# Altium schematic sheet POWER.SchDoc: POWER
size A3; Date: 13/11/2025; DrawnBy: Văn Quý Tuân; Revision: 1; SheetNumber: 1; SheetTotal: 10; Size: A3; Subsystem: HW-11/11/25
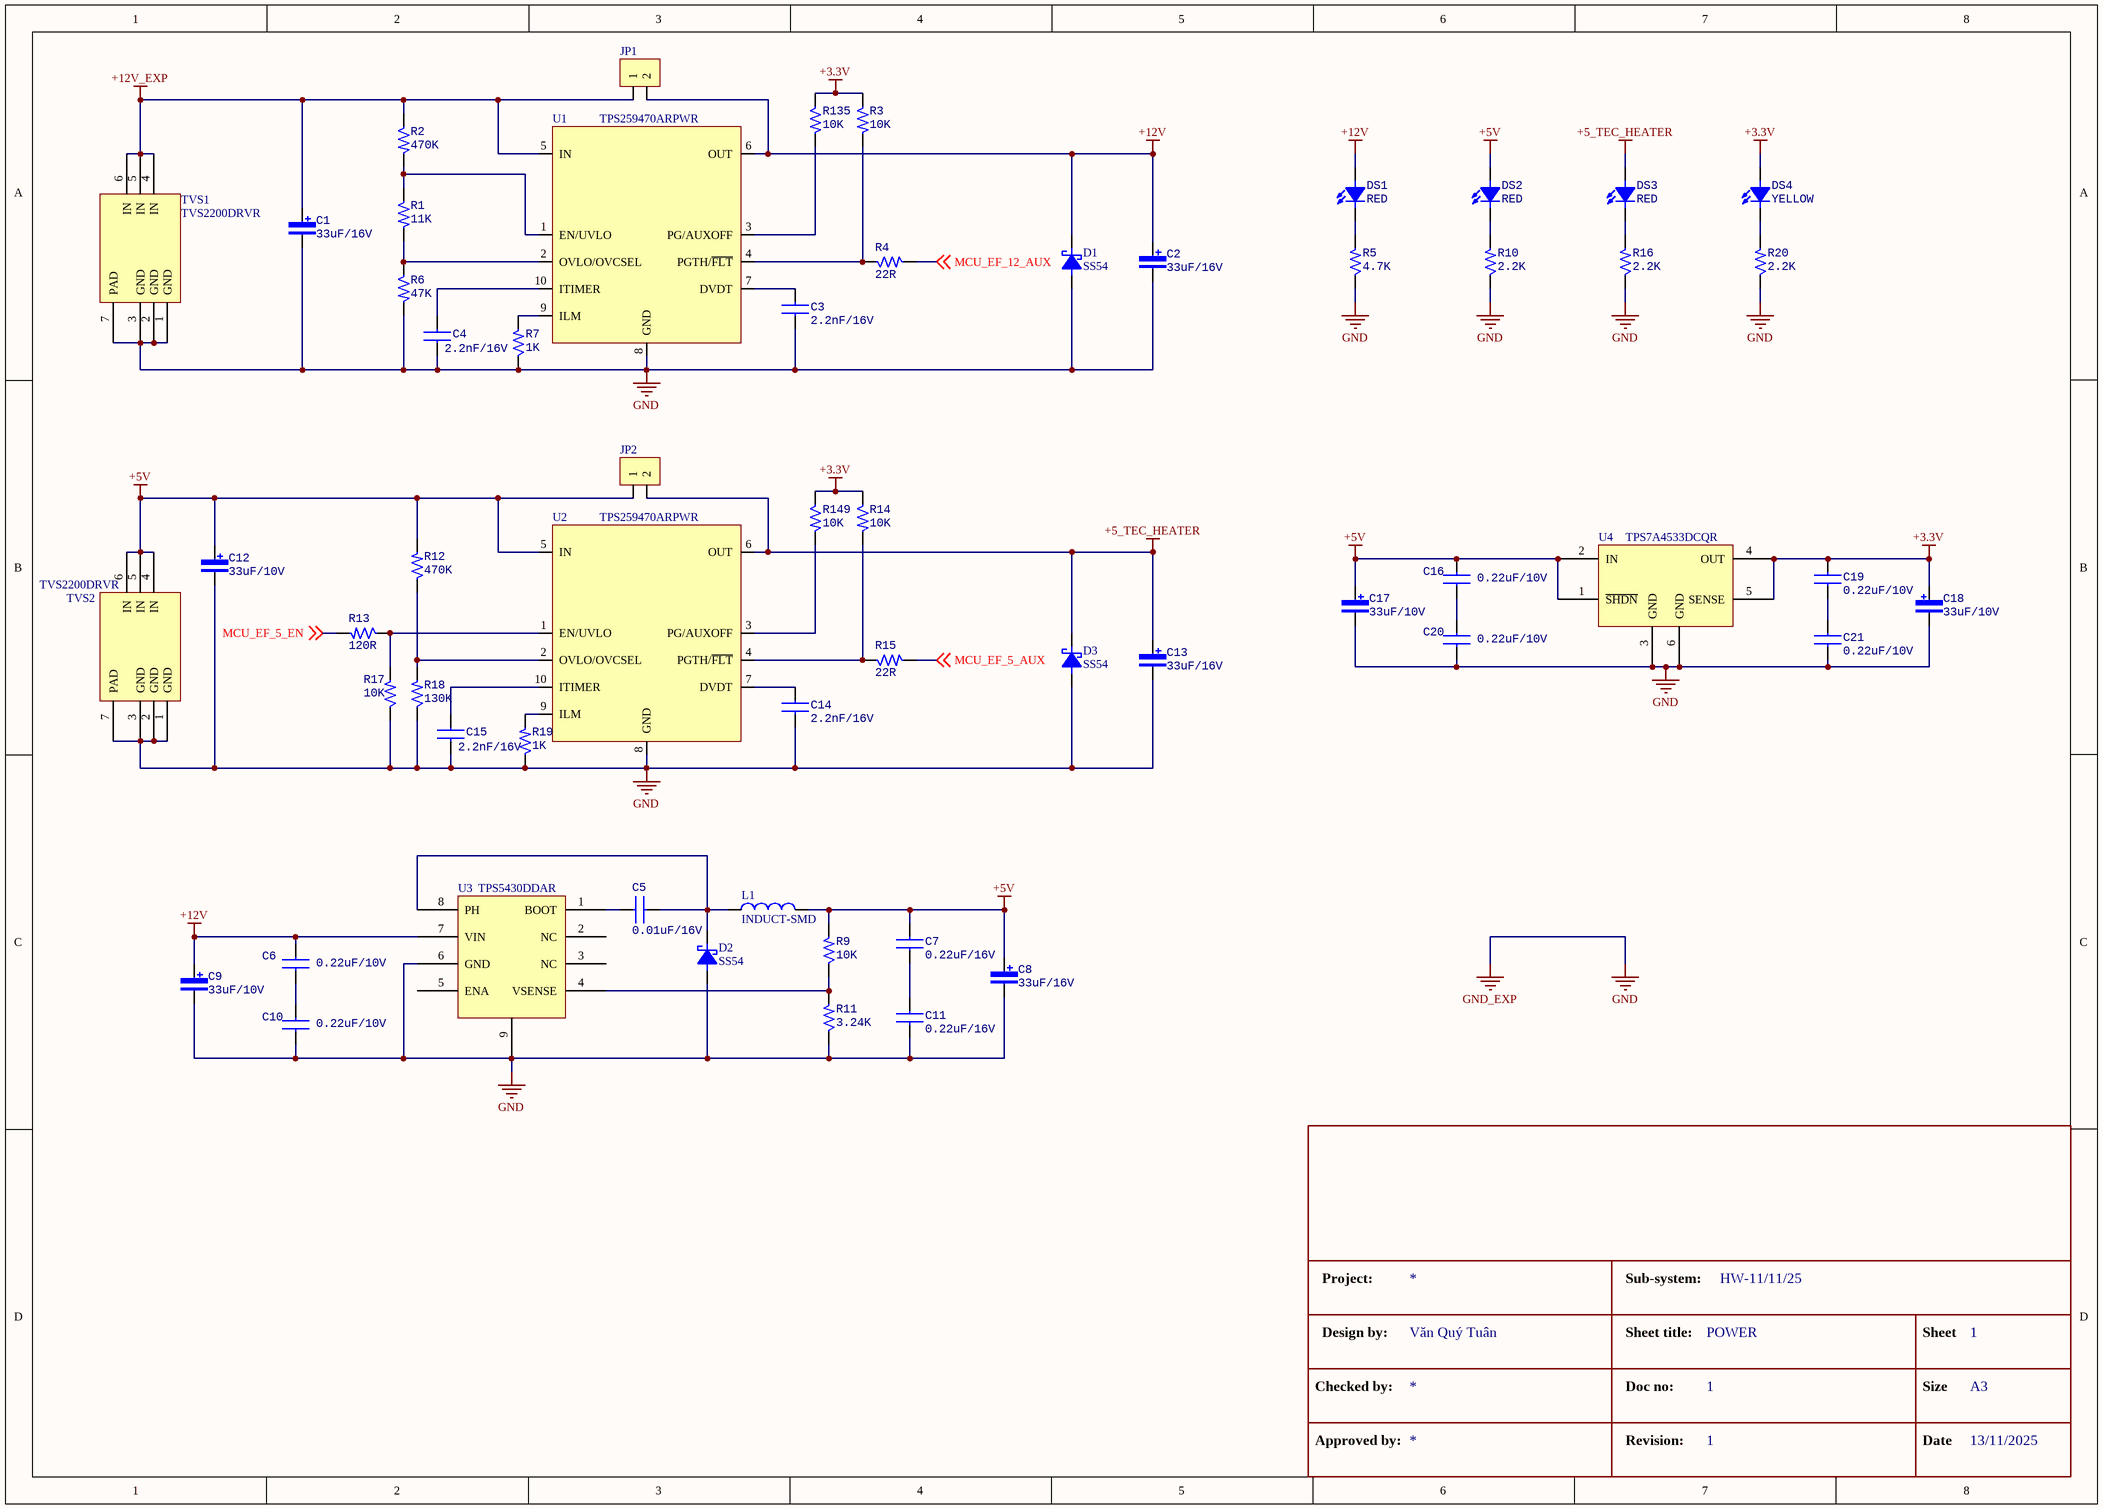
[diagram p0: POWER.SchDoc]

## Parts
C1  33uF/16V  [CAP-TAN-2312]
C2  33uF/16V  [CAP-TAN-2312]
C3  2.2nF/16V  [CAP-CER-0603]
C4  2.2nF/16V  [CAP-CER-0603]
C5  0.01uF/16V  [CAP-CER-0603]
C6  0.22uF/10V  [CAP-CER-0603]
C7  0.22uF/16V  [CAP-CER-0603]
C8  33uF/16V  [CAP-TAN-2312]
C9  33uF/10V  [CAP-TAN-2312]
C10  0.22uF/10V  [CAP-CER-0603]
C11  0.22uF/16V  [CAP-CER-0603]
C12  33uF/10V  [CAP-TAN-2312]
C13  33uF/16V  [CAP-TAN-2312]
C14  2.2nF/16V  [CAP-CER-0603]
C15  2.2nF/16V  [CAP-CER-0603]
C16  0.22uF/10V  [CAP-CER-0603]
C17  33uF/10V  [CAP-TAN-2312]
C18  33uF/10V  [CAP-TAN-2312]
C19  0.22uF/10V  [CAP-CER-0603]
C20  0.22uF/10V  [CAP-CER-0603]
C21  0.22uF/10V  [CAP-CER-0603]
D1  SS54  [DIODE SMA]
D2  SS54  [DIODE SMA]
D3  SS54  [DIODE SMA]
DS1  RED  [LED-SMD-0603]
DS2  RED  [LED-SMD-0603]
DS3  RED  [LED-SMD-0603]
DS4  YELLOW  [LED-SMD-0603]
JP1  JP 1x2 2.54  [JP 1x2 DT]  (value not drawn)
JP2  JP 1x2 2.54  [JP 1x2 DT]  (value not drawn)
L1  INDUCT-SMD  [INDUCTOR-FIXED IND 22UH 2.5A 170 MOHM SMD]
R1  11K  [RES-SMD-0603]
R2  470K  [RES-SMD-0603]
R3  10K  [RES-SMD-0603]
R4  22R  [RES-SMD-0603]
R5  4.7K  [RES-SMD-0603]
R6  47K  [RES-SMD-0603]
R7  1K  [RES-SMD-0603]
R9  10K  [RES-SMD-0603]
R10  2.2K  [RES-SMD-0603]
R11  3.24K  [RES-SMD-0603]
R12  470K  [RES-SMD-0603]
R13  120R  [RES-SMD-0603]
R14  10K  [RES-SMD-0603]
R15  22R  [RES-SMD-0603]
R16  2.2K  [RES-SMD-0603]
R17  10K  [RES-SMD-0603]
R18  130K  [RES-SMD-0603]
R19  1K  [RES-SMD-0603]
R20  2.2K  [RES-SMD-0603]
R135  10K  [RES-SMD-0603]
R149  10K  [RES-SMD-0603]
TVS1  TVS2200DRVR  [TVS2200DRVR]
TVS2  TVS2200DRVR  [TVS2200DRVR]
U1  TPS259470ARPWR  [VQFN-HR-10]
U2  TPS259470ARPWR  [VQFN-HR-10]
U3  TPS5430DDAR  [TPS5430DDAR]
U4  TPS7A4533DCQR  [TPS7A4533DCQR]

## Nets
+3.3V: C18.1 C19.2 DS4.A R3.1 R14.1 R135.1 R149.1 U4.4(OUT) U4.5(SENSE)
+5_TEC_HEATER: C13.1 D3.2(K) DS3.A JP2.2 U2.6(OUT)
+5V: C7.1 C8.1 C12.1 C16.2 C17.1 DS2.A JP2.1 L1.2 R9.2 R12.2 TVS2.4(IN) TVS2.5(IN) TVS2.6(IN) U2.5(IN) U4.1(~{SHDN}) U4.2(IN)
+12V: C2.1 C6.2 C9.1 D1.2(K) DS1.A JP1.2 U1.6(OUT) U3.7(VIN)
+12V_EXP: C1.1 JP1.1 R2.1 TVS1.4(IN) TVS1.5(IN) TVS1.6(IN) U1.5(IN)
GND: C1.2 C2.2 C3.1 C4.1 C8.2 C9.2 C10.1 C11.2 C12.2 C13.2 C14.1 C15.1 C17.2 C18.2 C20.1 C21.1 D1.1(A) D2.1(A) D3.1(A) R5.1 R6.2 R7.1 R10.1 R11.1 R16.1 R17.1 R18.1 R19.1 R20.1 TVS1.1(GND) TVS1.2(GND) TVS1.3(GND) TVS1.7(PAD) TVS2.1(GND) TVS2.2(GND) TVS2.3(GND) TVS2.7(PAD) U1.8(GND) U2.8(GND) U3.6(GND) U3.9(PAD) U4.3(GND) U4.6(GND)  [also labelled GND_EXP]
MCU_EF_5_AUX: R15.2 ; off-sheet MCU_EF_5_AUX
MCU_EF_5_EN: R13.2 ; off-sheet MCU_EF_5_EN
MCU_EF_12_AUX: R4.2 ; off-sheet MCU_EF_12_AUX
NetC3_2: C3.2 U1.7(DVDT)
NetC4_2: C4.2 U1.10(ITIMER)
NetC5_1: C5.1 D2.2(K) L1.1 U3.8(PH)
NetC5_2: C5.2 U3.1(BOOT)
NetC6_1: C6.1 C10.2
NetC7_2: C7.2 C11.1
NetC14_2: C14.2 U2.7(DVDT)
NetC15_2: C15.2 U2.10(ITIMER)
NetC16_1: C16.1 C20.2
NetC19_1: C19.1 C21.2
NetDS1_K: DS1.K R5.2
NetDS2_K: DS2.K R10.2
NetDS3_K: DS3.K R16.2
NetDS4_K: DS4.K R20.2
NetR1_1: R1.1 R2.2 U1.1(EN/UVLO)
NetR1_2: R1.2 R6.1 U1.2(OVLO/OVCSEL)
NetR3_2: R3.2 R4.1 U1.4(PGTH/~{FLT})
NetR7_2: R7.2 U1.9(ILM)
NetR9_1: R9.1 R11.2 U3.4(VSENSE)
NetR12_1: R12.1 R18.2 U2.2(OVLO/OVCSEL)
NetR13_1: R13.1 R17.2 U2.1(EN/UVLO)
NetR14_2: R14.2 R15.1 U2.4(PGTH/~{FLT})
NetR19_2: R19.2 U2.9(ILM)
NetR135_2: R135.2 U1.3(PG/AUXOFF)
NetR149_2: R149.2 U2.3(PG/AUXOFF)

Not connected (* = marked no-connect by the designer): U3 2(NC) 3(NC) 5(ENA)

## Notes on the sheet
- Project:
- Sub-system:
- Checked by:
- Design by:
- Sheet title:
- Doc no:
- Sheet
- Size
- Approved by:
- Revision:
- Date
- Text

## Library data of the parts
C1 C2 C8 C9 C12 C13 C17 C18 = CAP-TAN
C3-C7 C10 C11 C14-C16 C19-C21 = CAP-CER
D1-D3 = DIODE-SCHOTTKY
DS1-DS4 = LED
JP1 JP2 = JP 1x2 2.54 Duc Thang: Cắm; Ten_Linh_Kien: Jump Đơn Đực 2.54MM 1x40P Thẳng 11MM; Don_Vi: Con; Ma_Hang: MH000903; Ghi_Chu: *; Kieu_Chan: *; Chung_Loai: Cắm
L1 = INDUCT-SMD: MP: LQM18PZ2R2MFHD; MF: Murata; Price: None; Package: 1608 Murata; Value: *; SnapEDA_Link: https://www.snapeda.com/parts/LQM18PZ2R2MFHD/Murata/view-part/1498702/?ref=snap; Availability: Good; Check_prices: https://www.snapeda.com/parts/LQM18PZ2R2MFHD/Murata/view-part/1498702/?ref=eda; Purchase-URL: https://pricing.snapeda.com/search/part/LQM18PZ2R2MFHD/?ref=eda
R1-R7 R9-R20 R135 R149 = RES-SMD
U1 U2 = TPS259472ARPWR: 2.7-V–23-V, 5.5-A, 28-mΩ True Reverse Current Blocking eFuse with / Input Reverse Polarity Protection; Manufacturer: Texas Instruments; Manufacturer Part Number: TPS259472ARPWR